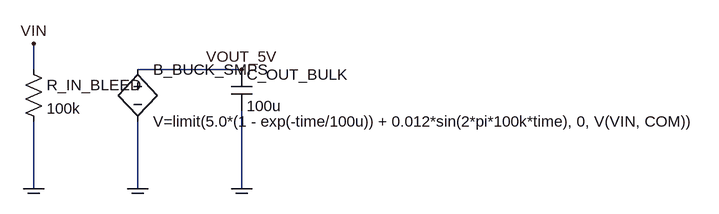
[diagram p0: schematic smps_buck.asc]
smps_buck.asc, the LTspice schematic file:
Version 4
SHEET 1 1200 800
FLAG 160 160 VIN
FLAG 480 200 VOUT_5V
FLAG 160 384 COM
FLAG 320 384 COM
FLAG 480 384 COM
WIRE 160 160 160 200
SYMBOL res 144 184 R0
SYMATTR InstName R_IN_BLEED
SYMATTR Value 100k
WIRE 160 280 160 384
SYMBOL bv 320 184 R0
SYMATTR InstName B_BUCK_SMPS
SYMATTR Value V=limit(5.0*(1 - exp(-time/100u)) + 0.012*sin(2*pi*100k*time), 0, V(VIN, COM))
WIRE 320 200 480 200
WIRE 320 280 320 384
SYMBOL cap 464 200 R0
SYMATTR InstName C_OUT_BULK
SYMATTR Value 100u
WIRE 480 264 480 384

The netlist it stands for:
* smps_buck.asc
R_IN_BLEED VIN COM 100k
B_BUCK_SMPS VOUT_5V COM V=limit(5.0*(1 - exp(-time/100u)) + 0.012*sin(2*pi*100k*time), 0, V(VIN, COM))
C_OUT_BULK VOUT_5V COM 100u
.backanno
.end